# Altium project Excavadora Bulldozer Electrica.PrjPcb
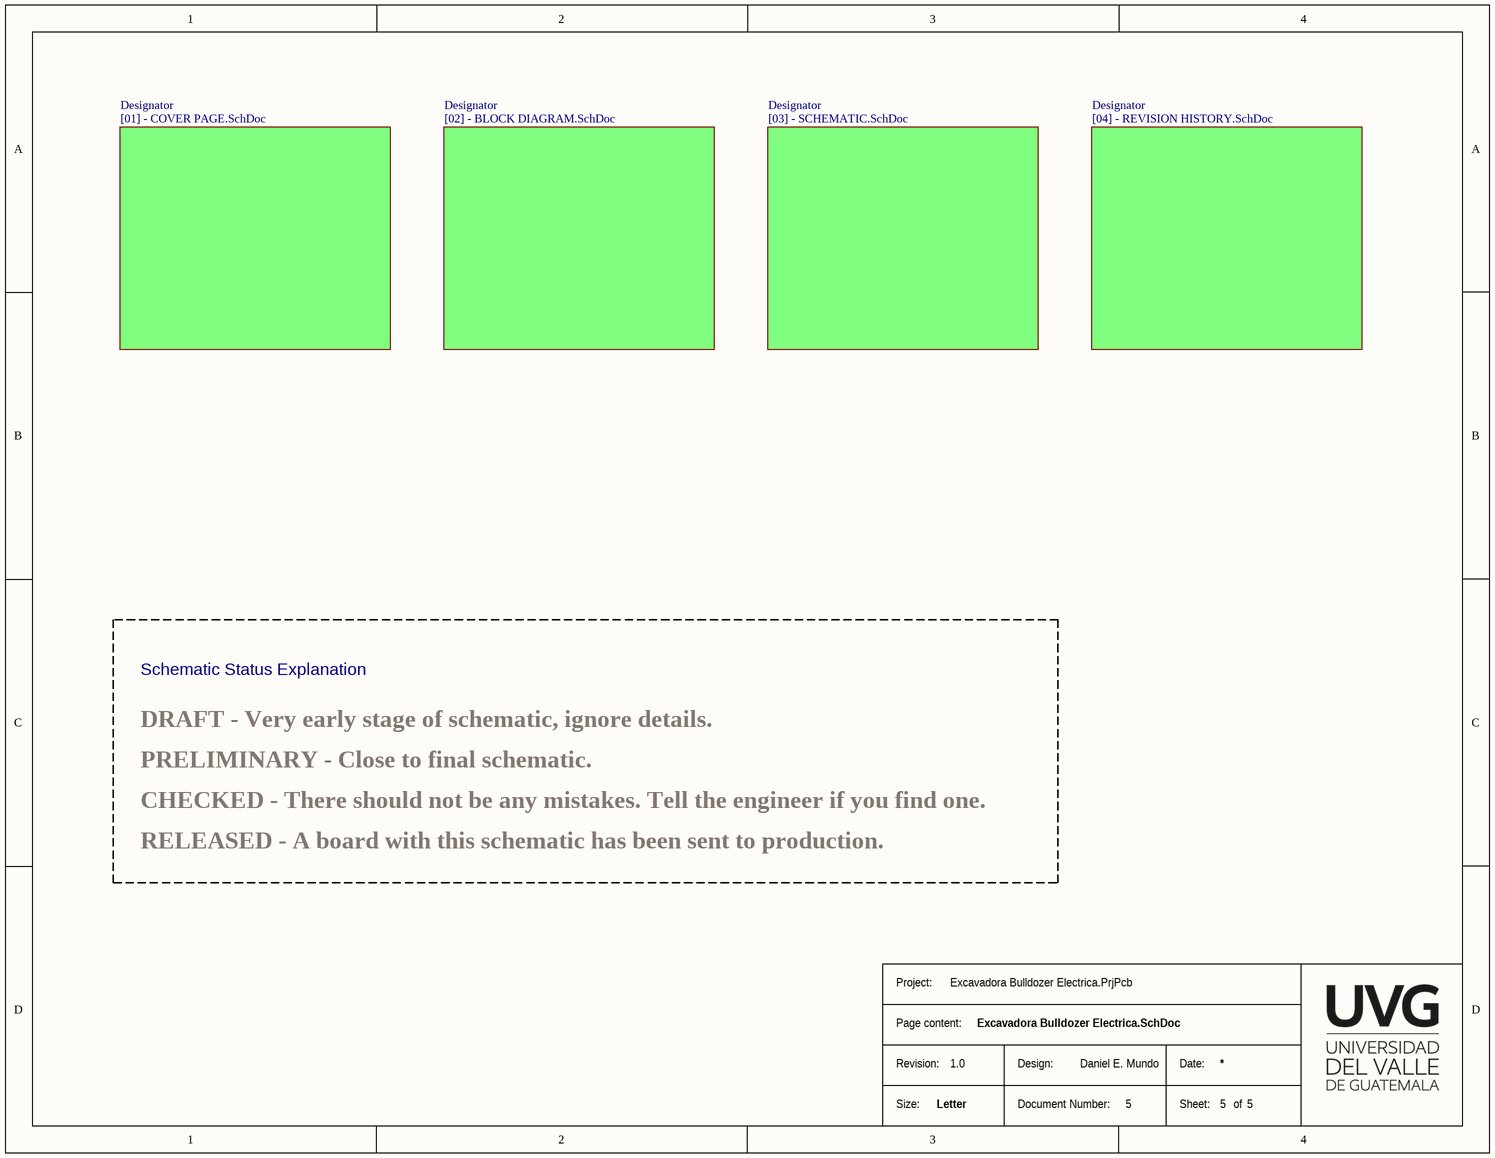
[diagram p0: Excavadora Bulldozer Electrica.SchDoc]
5 sheets, 7 parts. Net scope: flat (ports and power ports of the same name join across sheets).
Board file: Excavadora Bulldozer Electrica.PcbDoc
Sheets:
  Excavadora Bulldozer Electrica.SchDoc
    Designator = [01] - COVER PAGE.SchDoc
    Designator = [02] - BLOCK DIAGRAM.SchDoc
    Designator = [03] - SCHEMATIC.SchDoc
    Designator = [04] - REVISION HISTORY.SchDoc

## Sheet Excavadora Bulldozer Electrica.SchDoc
size Letter; Author: Daniel E. Mundo; DocumentNumber: 5; Revision: 1.0; SheetNumber: 5; SheetTotal: 5

### Sub-sheets
Designator = [01] - COVER PAGE.SchDoc: no entries
Designator = [02] - BLOCK DIAGRAM.SchDoc: no entries
Designator = [03] - SCHEMATIC.SchDoc: no entries
Designator = [04] - REVISION HISTORY.SchDoc: no entries

### Notes on the sheet
- Schematic Status Explanation
- PRELIMINARY - Close to final schematic.
- DRAFT - Very early stage of schematic, ignore details.
- CHECKED - There should not be any mistakes. Tell the engineer if you find one.
- RELEASED - A board with this schematic has been sent to production.
- Project:
- Page content:
- Revision:
- Size:
- Letter
- Design:
- Document Number:
- Date:
- Sheet:
- of

## Sheet [01] - COVER PAGE.SchDoc
size Letter; Author: Daniel E. Mundo; DocumentNumber: 1; Revision: 1.0; SheetNumber: 1; SheetTotal: 5
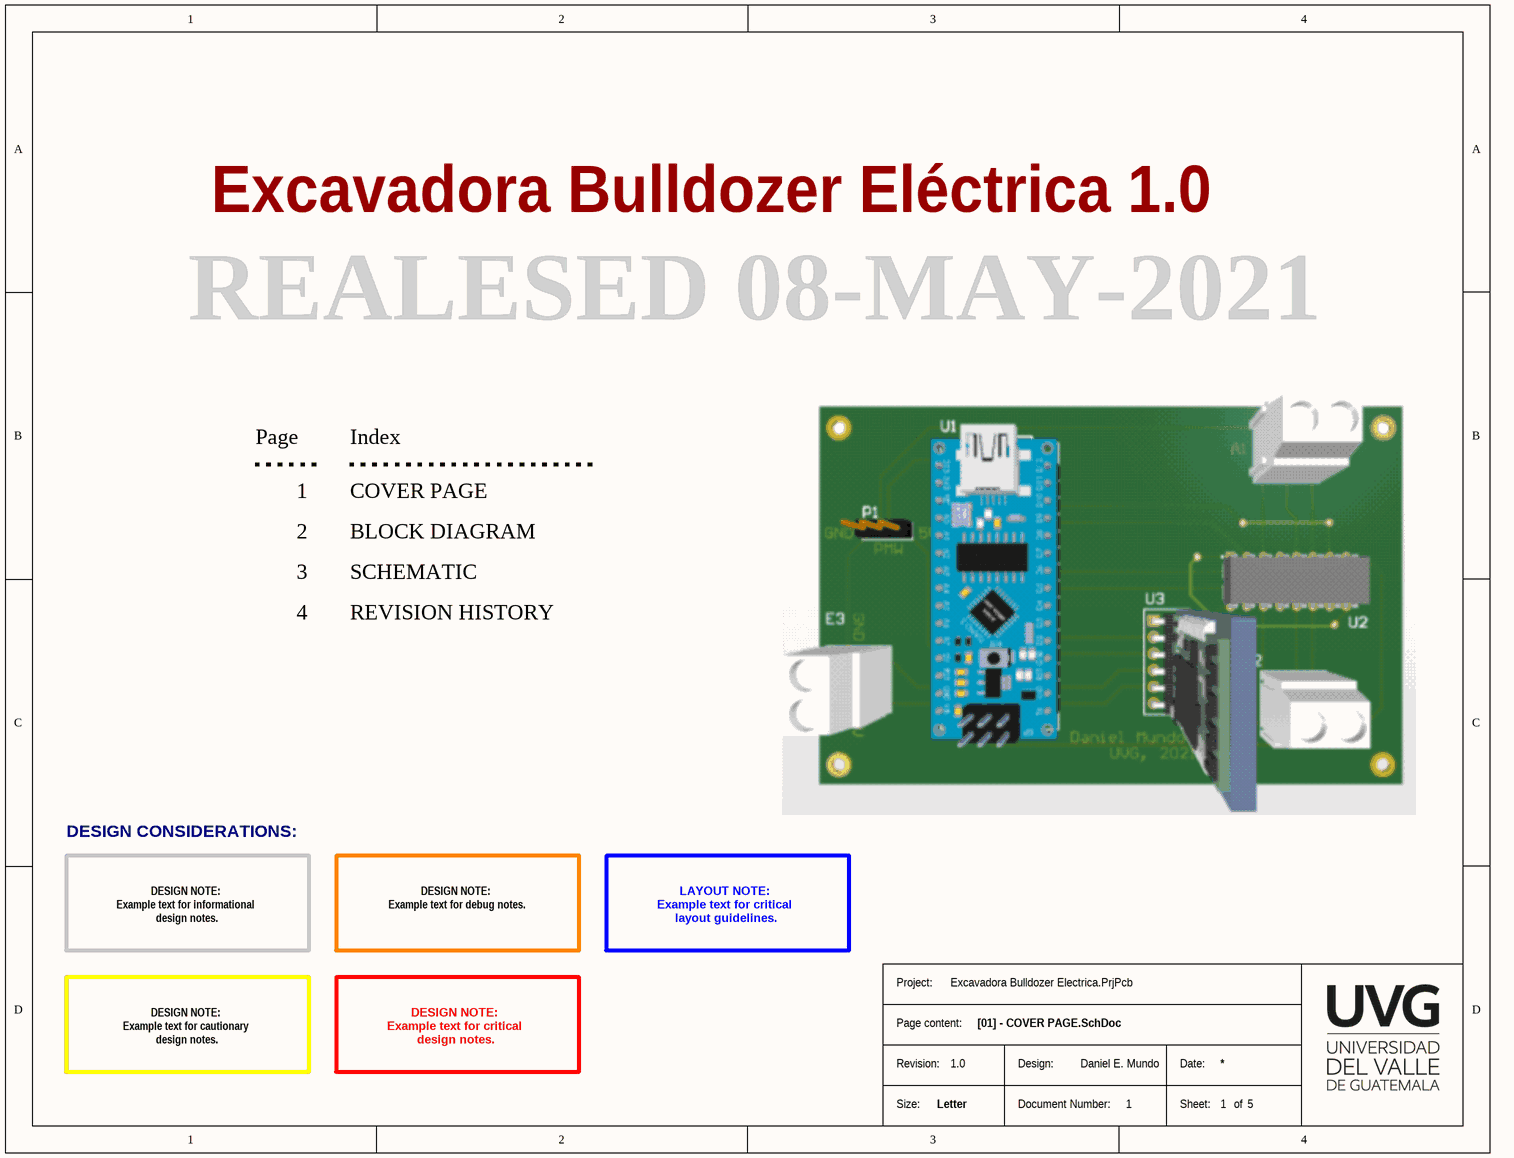
[diagram p1: [01] - COVER PAGE.SchDoc]

### Notes on the sheet
- Excavadora Bulldozer Eléctrica 1.0
- REALESED 08-MAY-2021
- Page
- 1
- Index
- COVER PAGE
- 2
- BLOCK DIAGRAM
- 3
- 4
- SCHEMATIC
- REVISION HISTORY
- DESIGN CONSIDERATIONS:
- DESIGN NOTE:
  Example text for debug notes.
- DESIGN NOTE:
  Example text for informational
  design notes.
- LAYOUT NOTE:
  Example text for critical
  layout guidelines.
- DESIGN NOTE:
  Example text for cautionary
  design notes.
- DESIGN NOTE:
  Example text for critical
  design notes.
- Project:
- Page content:
- Revision:
- Size:
- Letter
- Design:
- Document Number:
- Date:
- Sheet:
- of

## Sheet [02] - BLOCK DIAGRAM.SchDoc
size Letter; Author: Daniel E. Mundo; DocumentNumber: 2; Revision: 1.0; SheetNumber: 2; SheetTotal: 5
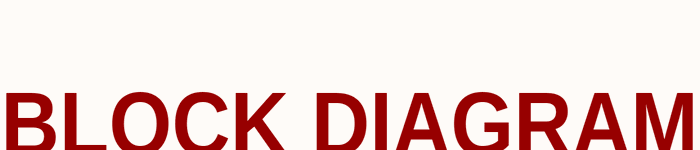
[diagram p2: [02] - BLOCK DIAGRAM.SchDoc]

### Notes on the sheet
- BLOCK DIAGRAM
- Project:
- Page content:
- Revision:
- Size:
- Letter
- Design:
- Document Number:
- Date:
- Sheet:
- of

## Sheet [03] - SCHEMATIC.SchDoc
size Letter; Author: Daniel E. Mundo; DocumentNumber: 3; Revision: 1.0; SheetNumber: 3; SheetTotal: 5
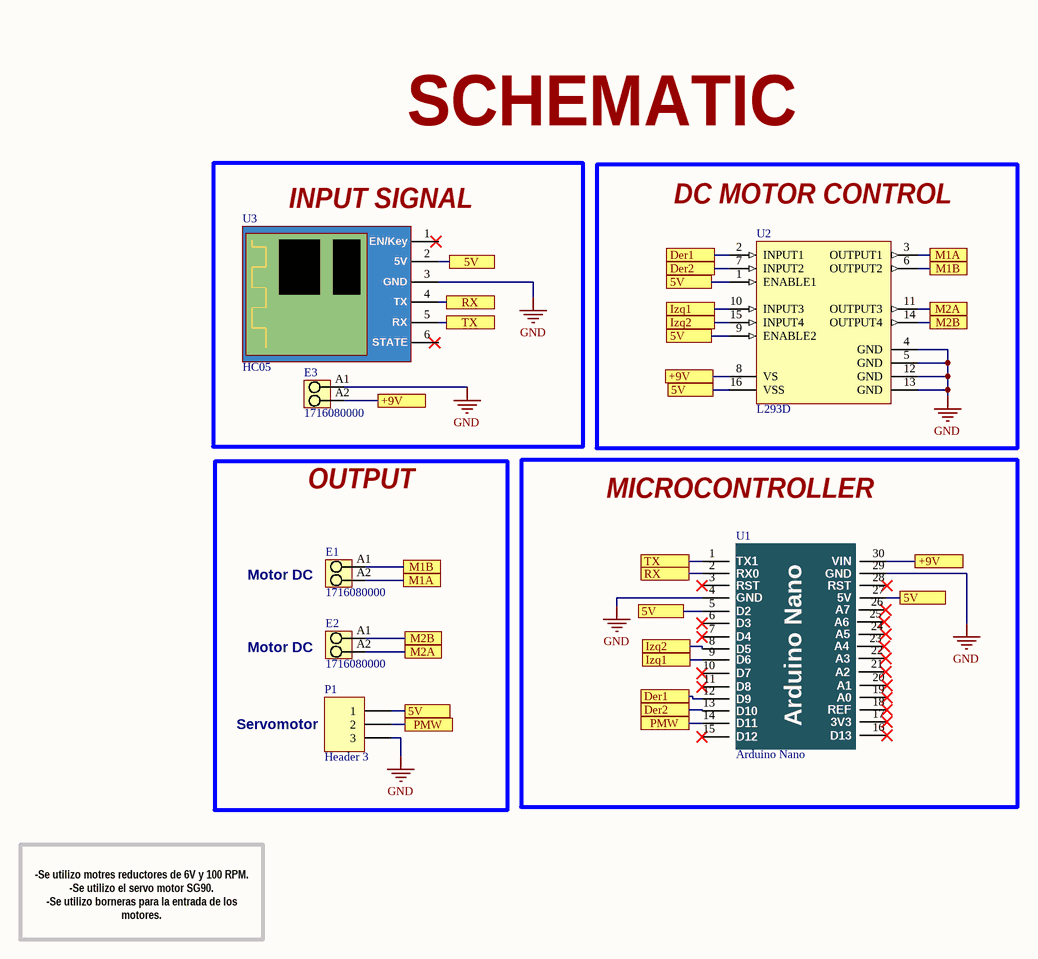
[diagram p3: [03] - SCHEMATIC.SchDoc]

### Parts
E1  1716080000  [LM_5_08_90_02]
E2  1716080000  [LM_5_08_90_02]
E3  1716080000  [LM_5_08_90_02]
P1  Header 3  [HDR1X3]
U1  Arduino Nano  [Arduino Nano]
U2  L293D  [STM-L293D-16]
U3  HC05  [HC05]

### Blocks framed on the sheet
INPUT SIGNAL: E3 U3
DC MOTOR CONTROL: U2
OUTPUT: E1 E2 P1
MICROCONTROLLER: U1

### Ports
5V, +9V, Der1, Der2, Izq1, Izq2, M1A, M1B, M2A, M2B, PMW, RX, TX

### Nets
GND: E3.A1(9V) P1.3 U1.4(GND) U1.29(GND) U2.4(GND) U2.5(GND) U2.12(GND) U2.13(GND) U3.3(GND)
NetE1_A1: E1.A1(M1_InA) U2.6(OUTPUT2) ; port M1B
NetE1_A2: E1.A2(M1_InB) U2.3(OUTPUT1) ; port M1A
NetE2_A1: E2.A1(M2_InA) U2.14(OUTPUT4) ; port M2B
NetE2_A2: E2.A2(M2_InB) U2.11(OUTPUT3) ; port M2A
NetE3_A2: E3.A2(GND) U1.30(VIN) U2.8(VS) ; port +9V
NetP1_1: P1.1 U1.5(D2) U1.27(5V) U2.1(ENABLE1) U2.9(ENABLE2) U2.16(VSS) U3.2(5V) ; port 5V
NetP1_2: P1.2 U1.14(D11) ; port PMW
NetU1_1: U1.1(TX1) U3.5(RX) ; port TX
NetU1_2: U1.2(RX0) U3.4(TX) ; port RX
NetU1_8: U1.8(D5) U2.15(INPUT4) ; port Izq2
NetU1_9: U1.9(D6) U2.10(INPUT3) ; port Izq1
NetU1_12: U1.12(D9) U2.2(INPUT1) ; port Der1
NetU1_13: U1.13(D10) U2.7(INPUT2) ; port Der2

Not connected (* = marked no-connect by the designer): U1 3(RST)* 6(D3)* 7(D4)* 10(D7)* 11(D8)* 15(D12)* 16(D13)* 17(3V3)* 18(REF)* 19(A0)* 20(A1)* 21(A2)* 22(A3)* 23(A4)* 24(A5)* 25(A6)* 26(A7)* 28(RST)*; U3 1(EN/Key) 6(STATE)

### Notes on the sheet
- SCHEMATIC
- Motor DC
- (near E2) Motor DC
- Servomotor
- -Se utilizo motres reductores de 6V y 100 RPM.
  -Se utilizo el servo motor SG90.
  -Se utilizo borneras para la entrada de los motores.
- Project:
- Page content:
- Revision:
- Size:
- Letter
- Design:
- Document Number:
- Date:
- Sheet:
- of

### Library data of the parts
E1-E3 = CMP-1559-01766-1: OMNIMATE Signal - series LM; Manufacturer: Weidmueller; Solder_pin_length_mm: 3,5 mm; Solid_max_H05_07_V_U: 2,5 mm²; Contact_material: Cu-Leg; No_of_poles: 2; Mounting_onto_the_PCB: Solder connection; Contact_surface: tinned; Wire_cross_section_AWG_max_UL_1059: AWG 14; Rated_voltage_for_surge_voltage_class_pollution_degree_II_2: 630 V; Side_termination_characteristic: closed side; UL_94_flammability_rating: V-0; Wire_cross_section_AWG_min_UL_1059: AWG 24; Pitch_mm: 5,08 mm; Pitch_inch: 0,2 inch; Rated_voltage_use_group_B_UL_1059: 300 V; Solid_min_H05_07_V_U: 0,2 mm²; Short_text_for_material: LM 5.08/02/90 3.5SN OR BX; Insulating_material: Wemid (PA); Rated_current_use_group_B_UL_1059: 15 A; PartNumber: 1716080000; Colour: Orange; ComponentLink1URL: http://www.weidmueller.com/; ComponentLink1Description: Manufacturer URL; Revision: V1; Qty: 500 PCS; ComponentLink2Description: URL Link1; ComponentLink2URL: http://catalog.weidmueller.com/catalog/Start.do?localeId=en&ObjectID=1716080000; Packaging: Box; PackageReference: LM_5_08_90_02
P1 = Header 3: Header, 3-Pin; LatestRevisionDate: 17-Jul-2002; LatestRevisionNote: Re-released for DXP Platform.; Publisher: Altium Limited
U1 = Arduino Nano: ARDUINO - A000005 - Development Board, Arduino Nano, ATmega328 MCU, 14 3.3V I/O, 6 PWM Outputs, USB Mini B; Operating Supply Voltage: 12V; Evaluation Kit: Yes; Interface: I2C,SPI,USB; Core Architecture: AVR; Number of Bits: 8; Data Bus Width: 8b; Supplier 1: Digi-Key; Manufacturer: Arduino; Manufacturer Part Number: A000005; Stock 1: 7864; Pricing 1: 1 = 22.00000, 10 = 20.90000, 100 = 19.80010, 500 = 18.70012 (USD); RoHS: Yes; Weight: 0.358383oz; Package Quantity: 50; Packaging: Bulk; Length: 7inch; Width: 5inch; Height: 0.25inch; REACH SVHC: No SVHC; ComponentLink1URL: https://datasheet.ciiva.com/2398/arduinonanomanual23-2398236.pdf?src-supplier=Digi-Key; ComponentLink1Description: https://datasheet.ciiva.com/2398/arduinonanomanual23-2398236.pdf?src-supplier=Digi-Key; ComponentLink2URL: https://datasheet.ciiva.com/4926/arduino-arduinoboardnano-188748-4926316.pdf?src-supplier=Mouser; ComponentLink2Description: https://datasheet.ciiva.com/4926/arduino-arduinoboardnano-188748-4926316.pdf?src-supplier=Mouser; ComponentLink3URL: https://datasheet.ciiva.com/20168/73-4448-20168542.pdf?src-supplier=Rapid+Electronics; ComponentLink3Description: https://datasheet.ciiva.com/20168/73-4448-20168542.pdf?src-supplier=Rapid+Electronics; ComponentLink4URL: https://datasheet.ciiva.com/19455/2121148-19455443.pdf?src-supplier=Jameco; ComponentLink4Description: https://datasheet.ciiva.com/19455/2121148-19455443.pdf?src-supplier=Jameco; ComponentLink5URL: https://datasheet.ciiva.com/1414/810078-1414124.pdf?src-supplier=Newark; ComponentLink5Description: https://datasheet.ciiva.com/1414/810078-1414124.pdf?src-supplier=Newark; ComponentLink6URL: https://datasheet.ciiva.com/1336/1682238-1336473.pdf?src-supplier=Element14; ComponentLink6Description: https://datasheet.ciiva.com/1336/1682238-1336473.pdf?src-supplier=Element14; Supplier Part Number 1: 1050-1001-ND
U2 = CMP-2000-06524-1: Push-Pull Four Channel Driver with Diode, 4.5 to 36 V, -40 to 150 degC, 16-Pin PDIP, RoHS, Tube; Manufacturer: STMicroelectronics; Number of Outputs: 4; Current - Peak Output: 1.2A; Current - Output / Channel: 600mA; Input Type: Non-Inverting; Other Related Documents: L293DViewAllSpecifications; Dynamic Catalog: HalfBridge; Voltage - Supply: 4.5V~36V; Other Names: 497-2936-5; Package / Case: 16-DIP(0.300",7.62mm); PartNumber: L293D; Operating Temperature: -40°C~150°C; Datasheet URL: http://www.st.com/st-web-ui/static/active/en/resource/technical/document/datasheet/CD00000059.pdf; Supplier Device Package: 16-PowerDIP; Packaging: Tube; Package Description: 16-Pin Thru-Hole Dual-In-Line, Body 20 x 6.85 mm, Pitch 2.54 mm; Standard Package: 25; Datasheet Version: 07/2003; On-State Resistance: -; Manufacturer URL: http://www.st.com/; Category: IntegratedCircuits(ICs); Family: PMIC-MOSFET,BridgeDrivers-InternalSwitch; Type: HalfBridge; Series: -; Mounting Technology: ThroughHole; Package Reference: DIP-16; Mounting Type: ThroughHole
U3 = HC05B2800000G: Manufacturer: Amphenol; Number of Levels: 1; Number of Positions Per Level: 5; Current: 2A; Voltage: 300V; Wire Gauge (Max): 26AWG; Wire Gauge (Min): 20AWG; Supplier 1: Mouser; Manufacturer Part Number: HC05B2800000G; Stock 1: 1975; Pricing 1: 1 = 0.67000, 10 = 0.61700, 50 = 0.57000, 100 = 0.56700, 1000 = 0.40400, 10000 = 0.32100 (USD); RoHS: Yes; Mount: Through Hole; Color: Grey; Contact Plating: Bronze,Tin; Housing Material: Thermoplastic; Min Operating Temperature: -40°C; Max Operating Temperature: 115°C; Packaging: Bulk; Termination: Screwless; RoHS Compliant: Yes; Supplier Part Number 1: 649-HC05B28000J0G

## Sheet [04] - REVISION HISTORY.SchDoc
size Letter; Author: Daniel E. Mundo; DocumentNumber: 4; Revision: 1.0; SheetNumber: 4; SheetTotal: 5
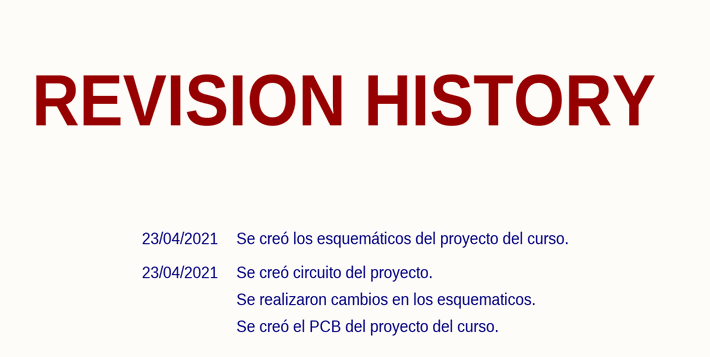
[diagram p4: [04] - REVISION HISTORY.SchDoc]

### Notes on the sheet
- REVISION HISTORY
- 23/04/2021
- Se creó los esquemáticos del proyecto del curso.
- Se creó circuito del proyecto.
- Se realizaron cambios en los esquematicos.
- Se creó el PCB del proyecto del curso.
- Project:
- Page content:
- Revision:
- Size:
- Letter
- Design:
- Document Number:
- Date:
- Sheet:
- of